# Altium project Rectifer.PrjPcb
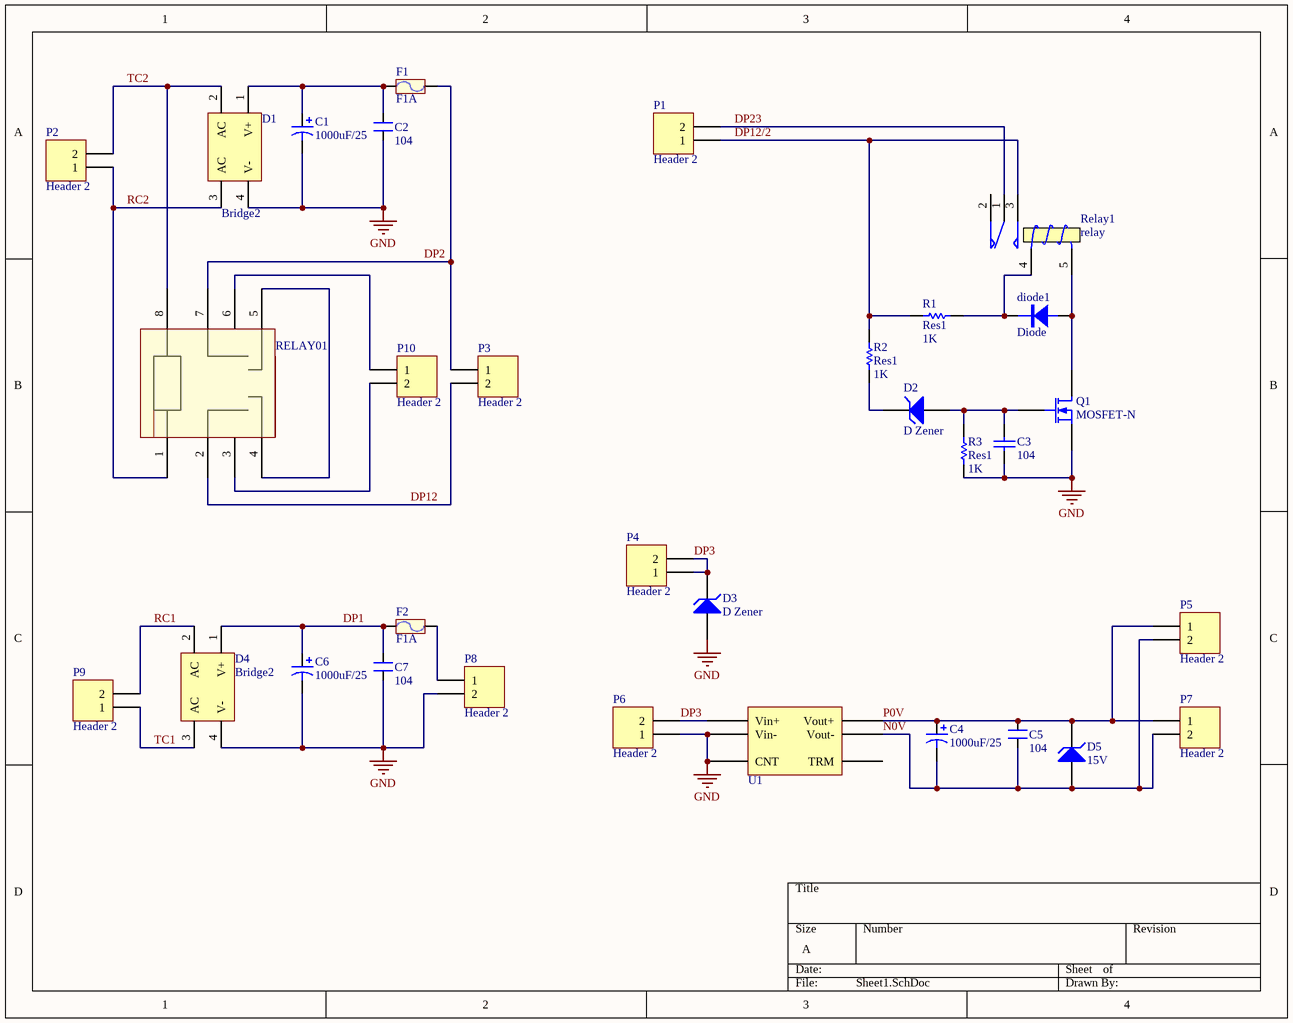
[diagram p0: Sheet1.SchDoc]
1 sheet, 32 parts. Net scope: global (net labels, ports and power ports of the same name join across sheets).
Board file: PCB1.PcbDoc

## Sheet Sheet1.SchDoc
size A

### Parts
C1  1000uF/25  [RB7.6-15]
C2  104  [CN3]
C3  104  [CN1.5]
C4  1000uF/25  [RB7.6-15]
C5  104  [CN3]
C6  1000uF/25  [RB7.6-15]
C7  104  [CN3]
D1  Bridge2  [KBU1010]
D2  D Zener  [DZ1A]
D3  D Zener  [DZ1A]
D4  Bridge2  [KBU1010]
D5  15V  [DZ1A]
diode1  Diode  [Diode s]
F1  F1A  [Fuse]
F2  F1A  [Fuse]
P1  Header 2  [CON2 5.08]
P2  Header 2  [CON2 5.08]
P3  Header 2  [CON2 5.08]
P4  Header 2  [CON2 5.08]
P5  Header 2  [CON2 5.08]
P6  Header 2  [CON2 5.08]
P7  Header 2  [CON2 5.08]
P8  Header 2  [CON2 5.08]
P9  Header 2  [CON2 5.08]
P10  Header 2  [CON2 5.08]
Q1  MOSFET-N  [Mosfet]
R1  Res1  value 1K  [AXIAL-0.3]
R2  Res1  value 1K  [AXIAL-0.3]
R3  Res1  value 1K  [AXIAL-0.3]
Relay1  relay  [Relay1]
RELAY01  DPDT 8 Pin Terminals Relay  [DPDT 8 Pin Terminals Relay]  (value not drawn)
U1  PP15  [PP15]  (value not drawn)

### Nets
GND: C1.2 C2.1 C3.1 C6.2 C7.1 D1.4(V-) D3.1(A) D4.4(V-) P6.1 P8.2 Q1.3(S) R3.1 U1.2(Vin-) U1.3(CNT)
DP1: C6.1 C7.2 D4.1(V+) F2.1
DP2: F1.2 P3.1 RELAY01.7
DP3: D3.2(K) P4.1 P4.2 P6.2 U1.1(Vin+)
DP12: P3.2 RELAY01.2
DP12/2: P1.1 R1.1 R2.2 Relay1.3(NO)
DP23: P1.2 Relay1.1(COM)
N0V: C4.2 C5.1 D5.1(A) P5.2 P7.2 U1.5(Vout-)
P0V: C4.1 C5.2 D5.2(K) P5.1 P7.1 U1.6(Vout+)
RC1: D4.2(AC) P9.2
RC2: D1.3(AC) P2.1 RELAY01.1
TC1: D4.3(AC) P9.1
TC2: D1.2(AC) P2.2 RELAY01.8
NetC1_1: C1.1 C2.2 D1.1(V+) F1.1
NetC3_2: C3.2 D2.1(A) Q1.2(G) R3.2
NetD2_2: D2.2(K) R2.1
Netdiode1_1: diode1.1 Q1.1(D) Relay1.5(T2)
Netdiode1_2: diode1.2 R1.2 Relay1.4(T1)
NetF2_2: F2.2 P8.1
NetP10_1: P10.1 RELAY01.6
NetP10_2: P10.2 RELAY01.3
NetRELAY01_4: RELAY01.4 RELAY01.5

Not connected (* = marked no-connect by the designer): Relay1 2(NC); U1 4(TRM)

### Library data of the parts
C1 C4 C6 = Cap Pol1: Polarized Capacitor (Radial); Value: 100pF; Published: 8-Jun-2000; LatestRevisionDate: 17-Jul-2002; LatestRevisionNote: Re-released for DXP Platform.; PackageReference: RB7.6-15; Publisher: Altium Limited; PackageDescription: Polarized Capacitor (Radial); 2 Leads
C2 C5 C7 = CN3: Cap np W0.3; Value: 0,047uF; Copyright: VanDungEvn
C3 = Cap: Capacitor; Value: 100pF; Published: 8-Jun-2000; LatestRevisionDate: 17-Jul-2002; LatestRevisionNote: Re-released for DXP Platform.; PackageReference: RAD-0.3; Publisher: Altium Limited; PackageDescription: Radial Cap, Thru-Hole; 2 Leads; 0.3 in Pin Spacing
D1 D4 = Bridge2: Diode Bridge; Published: 24-Mar-1999; LatestRevisionDate: 17-Jul-2002; LatestRevisionNote: Re-released for DXP Platform.; PackageReference: D-46_6A; Publisher: Altium Limited; PackageDescription: Bridge Rectifier; 4 Terminals; Body 16.8 x 16.8 mm (typ); Pitch 10.67 mm
D2 D3 D5 = D Zener: Zener Diode; Published: 8-Jun-2000; LatestRevisionDate: 17-Jul-2002; LatestRevisionNote: Re-released for DXP Platform.; PackageReference: DIODE-0.7; Publisher: Altium Limited; PackageDescription: Diode, Thru-Hole; 2 Leads; 0.7 in Pin Spacing
F1 F2 = Fuse: Designed by: VanDungEvn; Value: Fuse
P1-P10 = Header 2: Header, 2-Pin; LatestRevisionDate: 17-Jul-2002; LatestRevisionNote: Re-released for DXP Platform.; Publisher: Altium Limited
Q1 = MOSFET-N: N-Channel MOSFET; Published: 8-Jun-2000; LatestRevisionDate: 17-Jul-2002; LatestRevisionNote: Re-released for DXP Platform.; PackageVersion: 1995/1996; PackageReference: E3; Publisher: Altium Limited; PackageDescription: TO, Flat Index; 3 In-Line, Axial Leads; Body Dia. 4.6mm; Lead Dia. 0.5 mm (max)
R1-R3 = Res1: Resistor; Published: 8-Jun-2000; LatestRevisionDate: 17-Jul-2002; LatestRevisionNote: Re-released for DXP Platform.; PackageReference: AXIAL-0.3; Publisher: Altium Limited; PackageDescription: Axial Device, Thru-Hole; 2 Leads; 0.3 in Pin Spacing
Relay1 = Relay: SPDT Relay; Published: 8-Jun-2000; LatestRevisionDate: 17-Jul-2002; LatestRevisionNote: Re-released for DXP Platform.; PackageReference: MODULE5B; Publisher: Altium Limited